# Altium project AC225-16A-MHCW05P-B_V1.0.PrjPcb
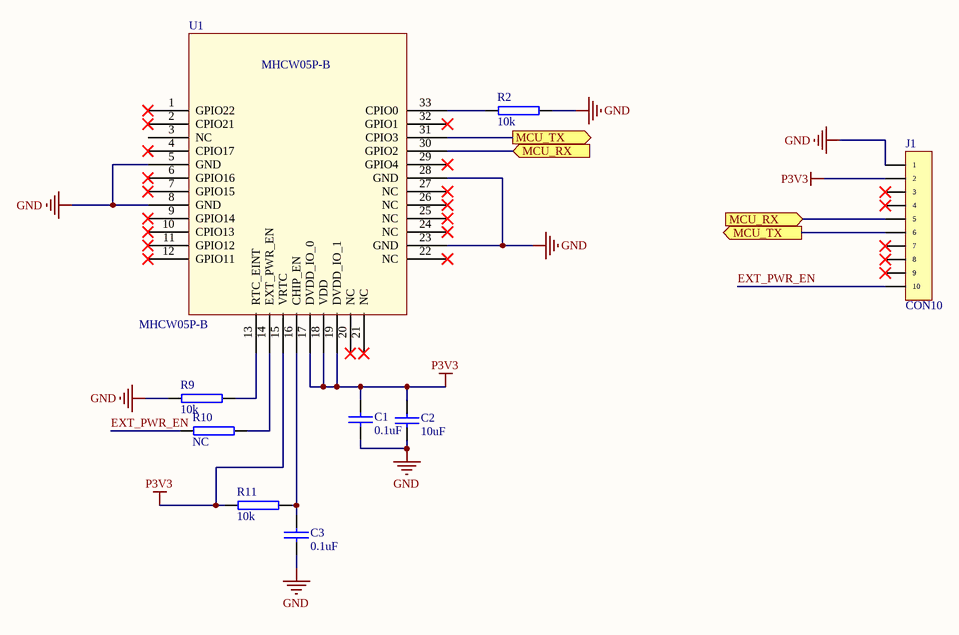
[diagram p0: AC225-16A-MHCW05P-B_V1.0.SchDoc]
1 sheet, 9 parts. Net scope: flat (ports and power ports of the same name join across sheets).
Board file: AC225-16A-MHCW05P-B_V1.0.PcbDoc

## Sheet AC225-16A-MHCW05P-B_V1.0.SchDoc
size A4

### Parts
C1  0.1uF  [C-0603]
C2  10uF  [C-0603]
C3  0.1uF  [C-0603]
J1  CON10  [DIP_10]
R2  10k  [R-0603]
R9  10k  [R-0603]
R10  NC  [R-0603]
R11  10k  [R-0603]
U1  MHCW05P-B  [MHCW05P-B]

### Ports
MCU_RX (in), MCU_TX (out)

### Nets
GND: C1.2 C2.2 C3.2 J1.1 R2.1 R9.2 U1.5(GND) U1.8(GND) U1.23(GND) U1.28(GND)
P3V3: C1.1 C2.1 J1.2 R11.2 U1.15(VRTC) U1.17(DVDD_IO_0) U1.18(VDD) U1.19(DVDD_IO_1)
EXT_PWR_EN: J1.10 R10.2
NetC3_1: C3.1 R11.1 U1.16(CHIP_EN)
NetJ1_5: J1.5 U1.30(GPIO2) ; port MCU_RX
NetJ1_6: J1.6 U1.31(CPIO3) ; port MCU_TX
NetR2_2: R2.2 U1.33(CPIO0)
NetR9_1: R9.1 U1.13(RTC_EINT)
NetR10_1: R10.1 U1.14(EXT_PWR_EN)

Not connected (* = marked no-connect by the designer): J1 3* 4* 7* 8* 9*; U1 1(GPIO22)* 2(CPIO21)* 3(NC) 4(CPIO17)* 6(GPIO16)* 7(GPIO15)* 9(GPIO14)* 10(CPIO13)* 11(GPIO12)* 12(GPIO11)* 20(NC)* 21(NC)* 22(NC)* 24(NC)* 25(NC)* 26(NC)* 27(NC)* 29(GPIO4)* 32(GPIO1)*

### Library data of the parts
C1-C3 = CAP
R2 R9-R11 = RES2